# Altium schematic sheet 43. HDMI BRIDGE.SchDoc: HDMI BRIDGE (part 1 of 2)
size 513 x 386 mm; Project: PROC154E2(001)_SK_AM69; Issue: 1.0; RevCode: E3; Page Create Date: March  8, 1995; Variant Name: Core Design; Schematic Page Number: 43; Page Number: 43; Page Size: C; Comment: MISTRAL_TITLEBLK_CSIZE_1; Page Count: 62; Schematic Page Count: 62; Name: PROC154E2 001 SK AM69; DsnPath: C:\Users\danie\Downloads\sprr466c\PROC154E3_RP\PROC154E3_SCH.DSN; SchematicName: SCHEMATIC1; PageName: 43. HDMI BRIDGE; PageSize: C; TopSchematic: True
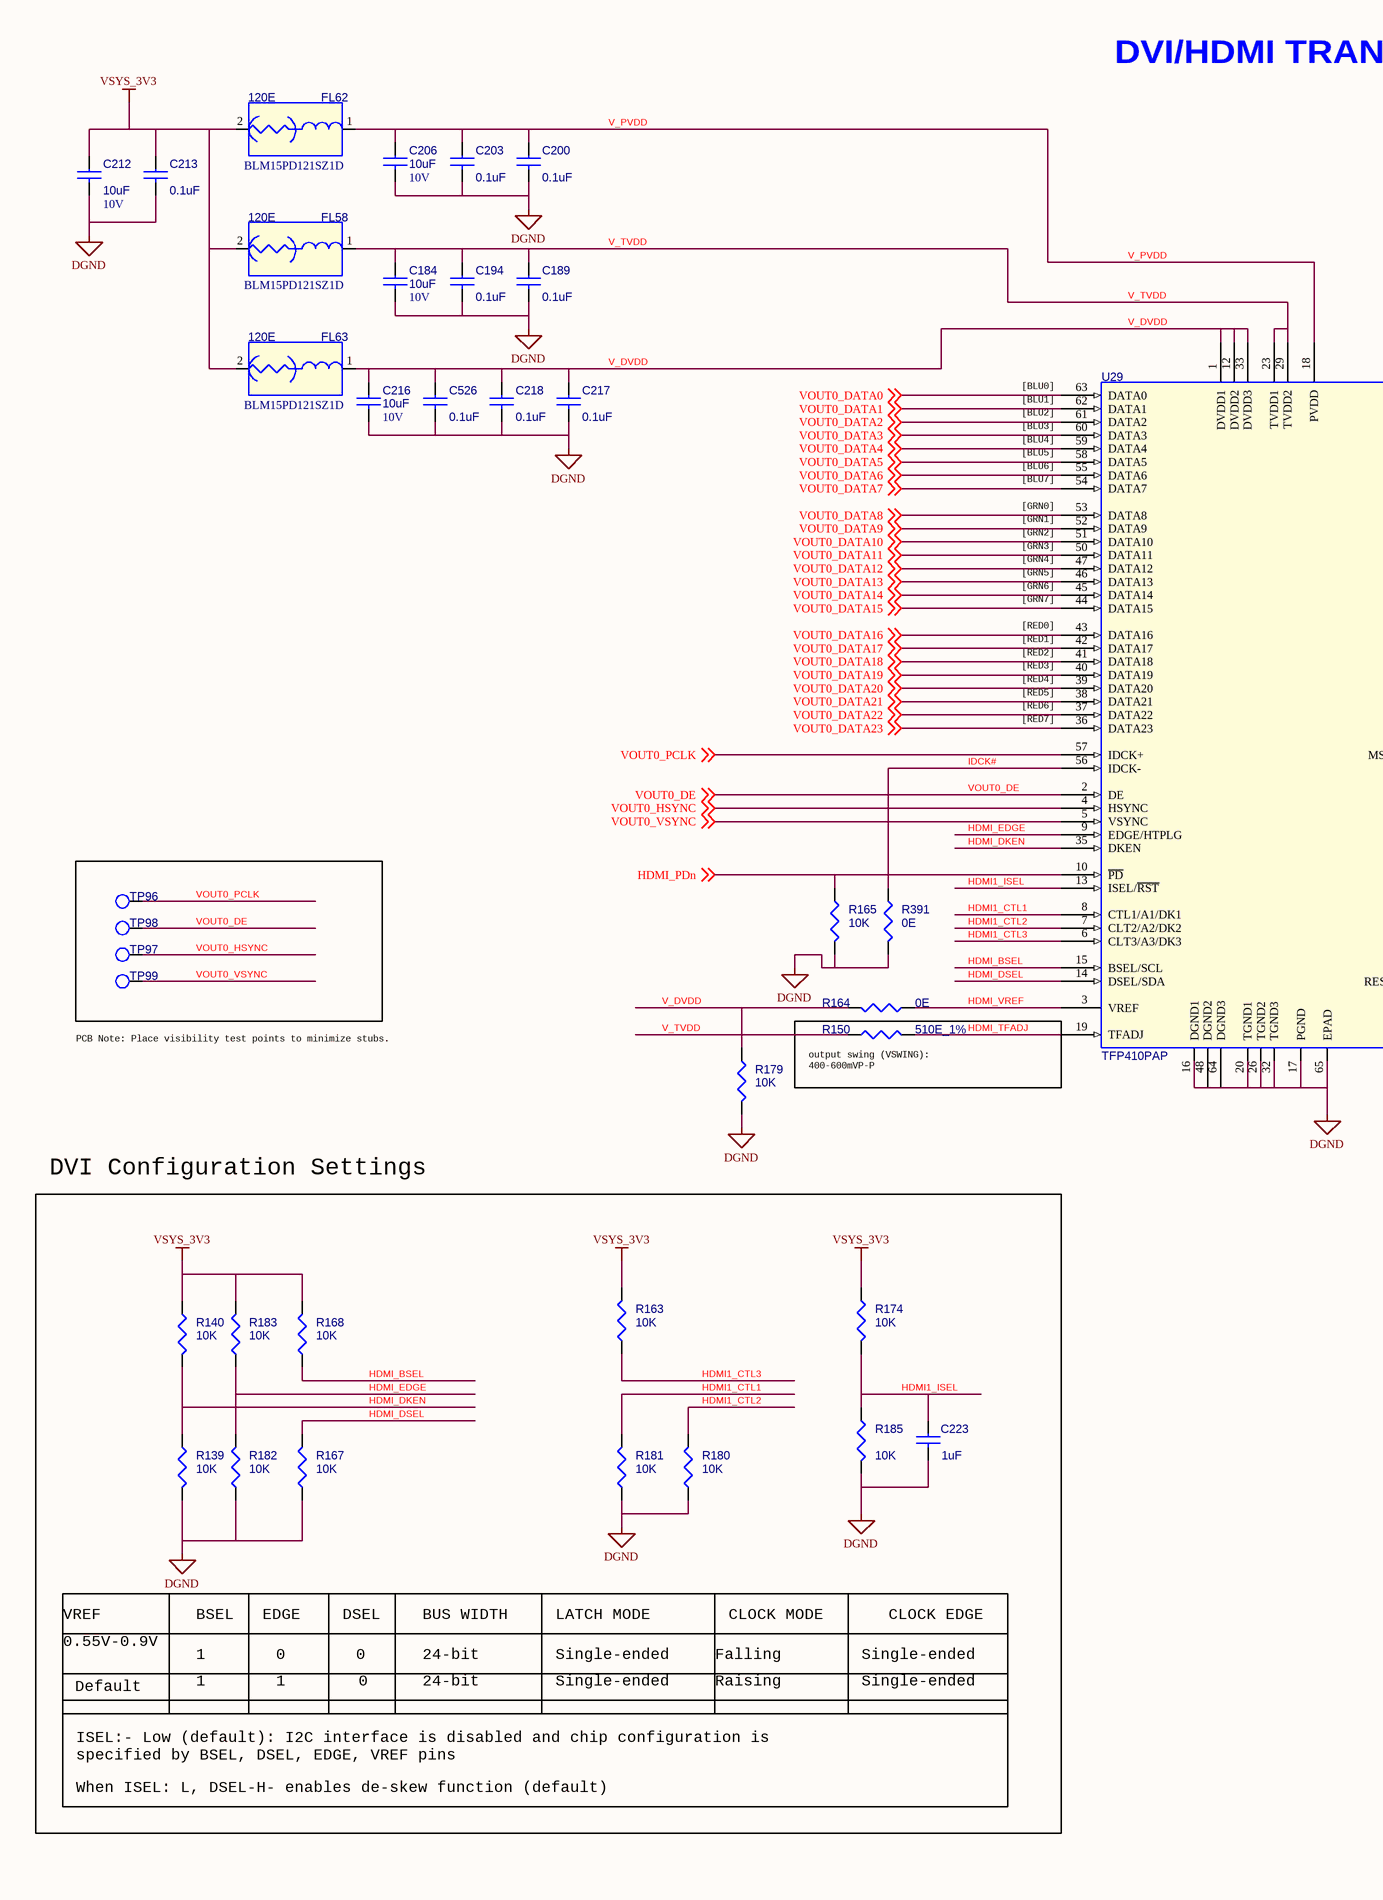
[diagram p0: 43. HDMI BRIDGE.SchDoc, left]
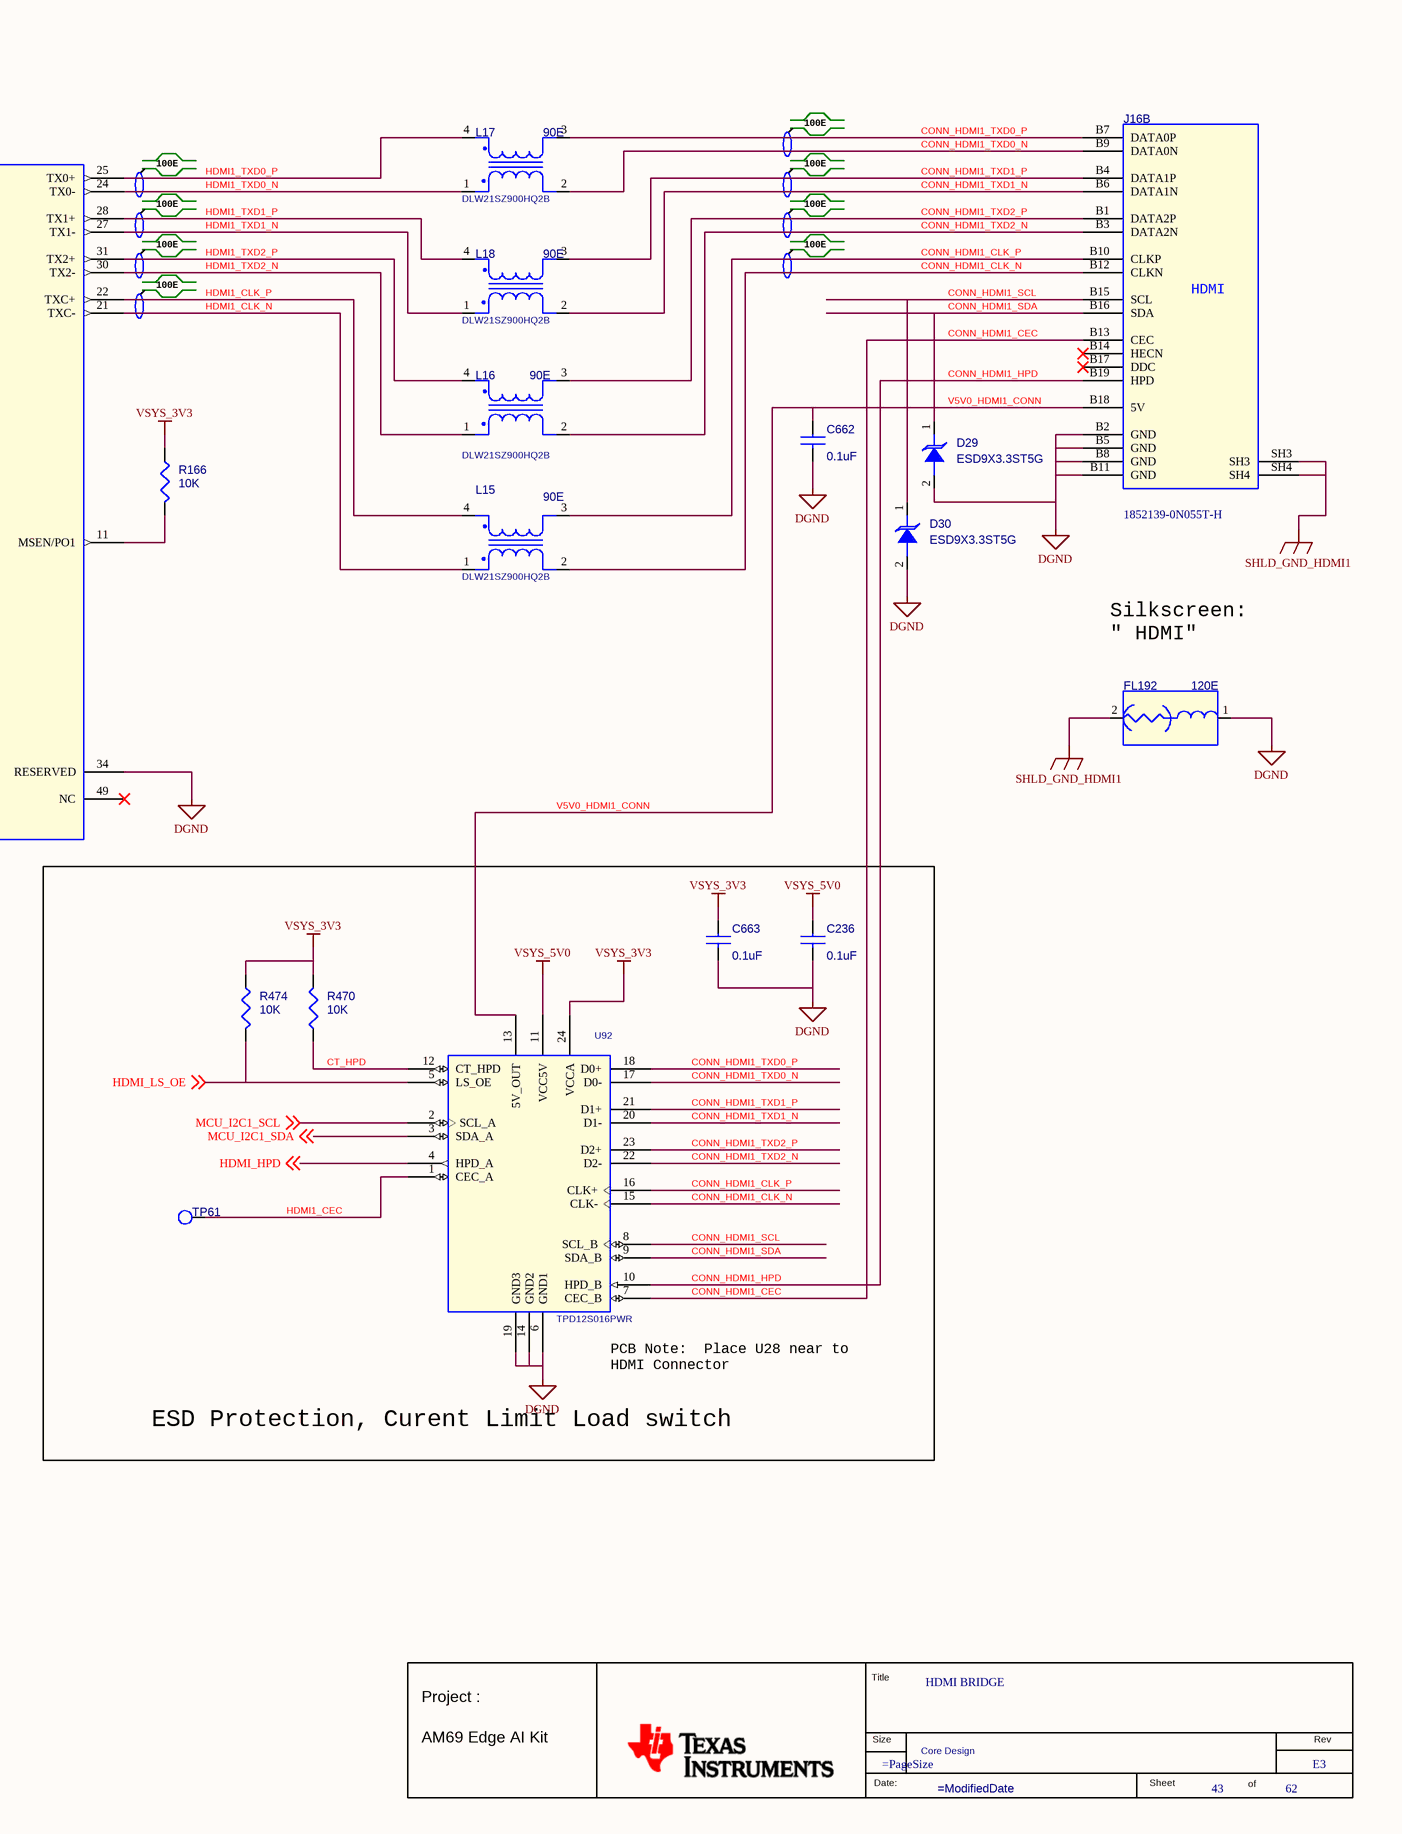
[diagram p1: 43. HDMI BRIDGE.SchDoc, right]

## Parts
*  RevCode: E3  Title: HDMI BRIDGE  Page Number: 43  Page Count: 62  Variant Name: Core Design  (hidden comment: MISTRAL_TITLEBLK_CSIZE_1)  (graphical)
C184  10uF  Voltage: 10V  [CAP0402_1]
C189  0.1uF  [CAP0201_0-5]
C194  0.1uF  [CAP0201_0-5]
C200  0.1uF  [CAP0201_0-5]
C203  0.1uF  [CAP0201_0-5]
C206  10uF  Voltage: 10V  [CAP0402_1]
C212  10uF  Voltage: 10V  [CAP0402_1]
C213  0.1uF  [CAP0201_0-5]
C216  10uF  Voltage: 10V  [CAP0402_1]
C217  0.1uF  [CAP0201_0-5]
C218  0.1uF  [CAP0201_0-5]
C223  1uF  [CAP0201_0-5]
C236  0.1uF  [CAP0201_0-5]
C526  0.1uF  [CAP0201_0-5]
C662  0.1uF  [CAP0201_0-5]
C663  0.1uF  [CAP0201_0-5]
D29  ESD9X3.3ST5G  [DIO_SOD923_0-5]
D30  ESD9X3.3ST5G  [DIO_SOD923_0-5]
FL58  120E  Mfr_part_number: BLM15PD121SZ1D  [EMIFIL_BLM15A_0402_0-6]
FL62  120E  Mfr_part_number: BLM15PD121SZ1D  [EMIFIL_BLM15A_0402_0-6]
FL63  120E  Mfr_part_number: BLM15PD121SZ1D  [EMIFIL_BLM15A_0402_0-6]
FL192  120E  [EMIFIL_BLM15A_0402_0-6]
J16  Mfr_part_number: 1852139-0N055T-H  [CON_HDMI-DP39_1852139-0N055_S_R_T_19-8]  (hidden comment: CON_HDMI-DP_39_F_1852139)  (part B of 2)
L15  90E  Mfr_part_number: DLW21SZ900HQ2B  [IND4_DLW21H_90X60_SMD_1-4]
L16  90E  Mfr_part_number: DLW21SZ900HQ2B  [IND4_DLW21H_90X60_SMD_1-4]
L17  90E  Mfr_part_number: DLW21SZ900HQ2B  [IND4_DLW21H_90X60_SMD_1-4]
L18  90E  Mfr_part_number: DLW21SZ900HQ2B  [IND4_DLW21H_90X60_SMD_1-4]
R139  10K  [RES0201_0-5]
R140  10K  [RES0201_0-5]
R150  510E_1%  [RES0402_0-5]
R163  10K  [RES0201_0-5]
R164  0E  [RES0402_0-5]
R165  10K  [RES0201_0-5]
R166  10K  [RES0402_0-5]
R167  10K  [RES0201_0-5]
R168  10K  [RES0201_0-5]
R174  10K  [RES0201_0-5]
R179  10K  [RES0201_0-5]
R180  10K  [RES0201_0-5]
R181  10K  [RES0201_0-5]
R182  10K  [RES0201_0-5]
R183  10K  [RES0201_0-5]
R185  10K  [RES0201_0-5]
R391  0E  [RES0402_0-5]
R470  10K  [RES0201_0-5]
R474  10K  [RES0201_0-5]
TP61  TP30_SMD  [TP30_SMD]  (value not drawn)
TP96  TP20_SMD  [TP20_SMD]  (value not drawn)
TP97  TP20_SMD  [TP20_SMD]  (value not drawn)
TP98  TP20_SMD  [TP20_SMD]  (value not drawn)
TP99  TP20_SMD  [TP20_SMD]  (value not drawn)
U29  TFP410PAP  [HTQFP64_19-68_400X400_1-2]
U92  TPD12S016PWR  [TSSOP24_25-59_315X180_1-2]

## Blocks framed on the sheet
ESD Protection, Curent Limit Load switch: C236 C663 R470 R474 TP61 U92
DVI Configuration Settings: C223 R139 R140 R163 R167 R168 R174 R180-R183 R185

## Nets
DGND: C184.2 C189.2 C194.2 C200.2 C203.2 C206.2 C212.2 C213.2 C216.2 C217.2 C218.2 C223.2 C236.2 C526.2 C662.2 C663.2 D29.2(ANODE) D30.2(ANODE) FL192.1 J16.B2(GND) J16.B5(GND) J16.B8(GND) J16.B11(GND) R139.2 R165.1 R167.2 R179.2 R180.2 R181.2 R182.2 R185.2 R391.2 U29.16(DGND1) U29.17(PGND) U29.20(TGND1) U29.26(TGND2) U29.32(TGND3) U29.34(RESERVED) U29.48(DGND2) U29.64(DGND3) U29.65(EPAD) U92.6(GND1) U92.14(GND2) U92.19(GND3)
SHLD_GND_HDMI1: FL192.2 J16.SH3 J16.SH4
VSYS_3V3: C212.1 C213.1 C663.1 FL58.2 FL62.2 FL63.2 R140.1 R163.1 R166.2 R168.1 R174.1 R183.1 R470.2 R474.1 U92.24(VCCA)
VSYS_5V0: C236.1 U92.11(VCC5V)
CONN_HDMI1_CEC: J16.B13(CEC) U92.7(CEC_B)
CONN_HDMI1_CLK_N: J16.B12(CLKN) L15.2(IN2) U92.15(CLK-)
CONN_HDMI1_CLK_P: J16.B10(CLKP) L15.3(OUT1) U92.16(CLK+)
CONN_HDMI1_HPD: J16.B19(HPD) U92.10(HPD_B)
CONN_HDMI1_SCL: D30.1(CATHODE) J16.B15(SCL) U92.8(SCL_B)
CONN_HDMI1_SDA: D29.1(CATHODE) J16.B16(SDA) U92.9(SDA_B)
CONN_HDMI1_TXD0_N: J16.B9(DATA0N) L17.2(IN2) U92.17(D0-)
CONN_HDMI1_TXD0_P: J16.B7(DATA0P) L17.3(OUT1) U92.18(D0+)
CONN_HDMI1_TXD1_N: J16.B6(DATA1N) L18.2(IN2) U92.20(D1-)
CONN_HDMI1_TXD1_P: J16.B4(DATA1P) L18.3(OUT1) U92.21(D1+)
CONN_HDMI1_TXD2_N: J16.B3(DATA2N) L16.2(IN2) U92.22(D2-)
CONN_HDMI1_TXD2_P: J16.B1(DATA2P) L16.3(OUT1) U92.23(D2+)
CT_HPD: R470.1 U92.12(CT_HPD)
HDMI1_CEC: TP61.1(TP) U92.1(CEC_A)
HDMI1_CLK_N: L15.1(IN1) U29.21(TXC-)
HDMI1_CLK_P: L15.4(OUT2) U29.22(TXC+)
HDMI1_CTL1: R181.1 U29.8(CTL1/A1/DK1)
HDMI1_CTL2: R180.1 U29.7(CLT2/A2/DK2)
HDMI1_CTL3: R163.2 U29.6(CLT3/A3/DK3)
HDMI1_ISEL: C223.1 R174.2 R185.1 U29.13(ISEL/~{RST})
HDMI1_TXD0_N: L17.1(IN1) U29.24(TX0-)
HDMI1_TXD0_P: L17.4(OUT2) U29.25(TX0+)
HDMI1_TXD1_N: L18.1(IN1) U29.27(TX1-)
HDMI1_TXD1_P: L18.4(OUT2) U29.28(TX1+)
HDMI1_TXD2_N: L16.1(IN1) U29.30(TX2-)
HDMI1_TXD2_P: L16.4(OUT2) U29.31(TX2+)
HDMI_BSEL: R168.2 U29.15(BSEL/SCL)
HDMI_DKEN: R139.1 R140.2 U29.35(DKEN)
HDMI_DSEL: R167.1 U29.14(DSEL/SDA)
HDMI_EDGE: R182.1 R183.2 U29.9(EDGE/HTPLG)
HDMI_HPD: U92.4(HPD_A) ; off-sheet HDMI_HPD
HDMI_LS_OE: R474.2 U92.5(LS_OE) ; off-sheet HDMI_LS_OE
HDMI_PDn: R165.2 U29.10(~{PD}) ; off-sheet HDMI_PDn
HDMI_TFADJ: R150.2 U29.19(TFADJ)
HDMI_VREF: R164.1 U29.3(VREF)
IDCK#: R391.1 U29.56(IDCK-)
MCU_I2C1_SCL: U92.2(SCL_A) ; off-sheet MCU_I2C1_SCL
MCU_I2C1_SDA: U92.3(SDA_A) ; off-sheet MCU_I2C1_SDA
V5V0_HDMI1_CONN: C662.1 J16.B18(5V) U92.13(5V_OUT)
V_DVDD: C216.1 C217.1 C218.1 C526.1 FL63.1 R164.2 R179.1 U29.1(DVDD1) U29.12(DVDD2) U29.33(DVDD3)
V_PVDD: C200.1 C203.1 C206.1 FL62.1 U29.18(PVDD)
V_TVDD: C184.1 C189.1 C194.1 FL58.1 R150.1 U29.23(TVDD1) U29.29(TVDD2)
VOUT0_DATA0: U29.63(DATA0) ; off-sheet VOUT0_DATA0
VOUT0_DATA1: U29.62(DATA1) ; off-sheet VOUT0_DATA1
VOUT0_DATA2: U29.61(DATA2) ; off-sheet VOUT0_DATA2
VOUT0_DATA3: U29.60(DATA3) ; off-sheet VOUT0_DATA3
VOUT0_DATA4: U29.59(DATA4) ; off-sheet VOUT0_DATA4
VOUT0_DATA5: U29.58(DATA5) ; off-sheet VOUT0_DATA5
VOUT0_DATA6: U29.55(DATA6) ; off-sheet VOUT0_DATA6
VOUT0_DATA7: U29.54(DATA7) ; off-sheet VOUT0_DATA7
VOUT0_DATA8: U29.53(DATA8) ; off-sheet VOUT0_DATA8
VOUT0_DATA9: U29.52(DATA9) ; off-sheet VOUT0_DATA9
VOUT0_DATA10: U29.51(DATA10) ; off-sheet VOUT0_DATA10
VOUT0_DATA11: U29.50(DATA11) ; off-sheet VOUT0_DATA11
VOUT0_DATA12: U29.47(DATA12) ; off-sheet VOUT0_DATA12
VOUT0_DATA13: U29.46(DATA13) ; off-sheet VOUT0_DATA13
VOUT0_DATA14: U29.45(DATA14) ; off-sheet VOUT0_DATA14
VOUT0_DATA15: U29.44(DATA15) ; off-sheet VOUT0_DATA15
VOUT0_DATA16: U29.43(DATA16) ; off-sheet VOUT0_DATA16
VOUT0_DATA17: U29.42(DATA17) ; off-sheet VOUT0_DATA17
VOUT0_DATA18: U29.41(DATA18) ; off-sheet VOUT0_DATA18
VOUT0_DATA19: U29.40(DATA19) ; off-sheet VOUT0_DATA19
VOUT0_DATA20: U29.39(DATA20) ; off-sheet VOUT0_DATA20
VOUT0_DATA21: U29.38(DATA21) ; off-sheet VOUT0_DATA21
VOUT0_DATA22: U29.37(DATA22) ; off-sheet VOUT0_DATA22
VOUT0_DATA23: U29.36(DATA23) ; off-sheet VOUT0_DATA23
VOUT0_DE: TP98.1(TP) U29.2(DE) ; off-sheet VOUT0_DE
VOUT0_HSYNC: TP97.1(TP) U29.4(HSYNC) ; off-sheet VOUT0_HSYNC
VOUT0_PCLK: TP96.1(TP) U29.57(IDCK+) ; off-sheet VOUT0_PCLK
VOUT0_VSYNC: TP99.1(TP) U29.5(VSYNC) ; off-sheet VOUT0_VSYNC
NetR166_1: R166.1 U29.11(MSEN/PO1)

Not connected (* = marked no-connect by the designer): J16 B14(HECN)* B17(DDC)*; U29 49(NC)*

## Notes on the sheet
- DVI/HDMI TRANSMITTER
- 100E
- (near U29) [BLU0]
- (near U29) [BLU1]
- (near U29) [BLU2]
- (near U29) [BLU3]
- (near U29) [BLU4]
- (near U29) [BLU5]
- (near U29) [BLU6]
- (near U29) [BLU7]
- (near U29) [GRN0]
- (near U29) [GRN1]
- (near U29) [GRN2]
- (near U29) [GRN3]
- (near U29) [GRN4]
- (near U29) [GRN5]
- (near U29) [GRN6]
- (near U29) [GRN7]
- (near U29) [RED0]
- (near U29) [RED1]
- (near U29) [RED2]
- (near U29) [RED3]
- (near U29) [RED4]
- (near U29) [RED5]
- (near U29) [RED6]
- (near U29) [RED7]
- Silkscreen:
  " HDMI"
- PCB Note: Place visibility test points to minimize stubs.
- (near R150) output swing (VSWING):
  400-600mVP-P
- (near U92) PCB Note:  Place U28 near to
  HDMI Connector
- VREF
- BSEL
- EDGE
- DSEL
- BUS WIDTH
- LATCH MODE
- CLOCK MODE
- CLOCK EDGE
- 0.55V-0.9V
- Default
- 1
- 0
- 24-bit
- Single-ended
- Raising
- Falling
- ISEL:- Low (default): I2C interface is disabled and chip configuration is
  specified by BSEL, DSEL, EDGE, VREF pins
- When ISEL: L, DSEL-H- enables de-skew function (default)
- (in symbol CON_HDMI-DP_39_F_1852139, part B) HDMI
- (in symbol MISTRAL_TITLEBLK_CSIZE_1) Title; Project :; Size; Rev; AM69 Edge AI Kit; Date:; Sheet; of